# Altium schematic sheet AttoDD.SchDoc
size A4; SheetNumber: 1; SheetTotal: 1
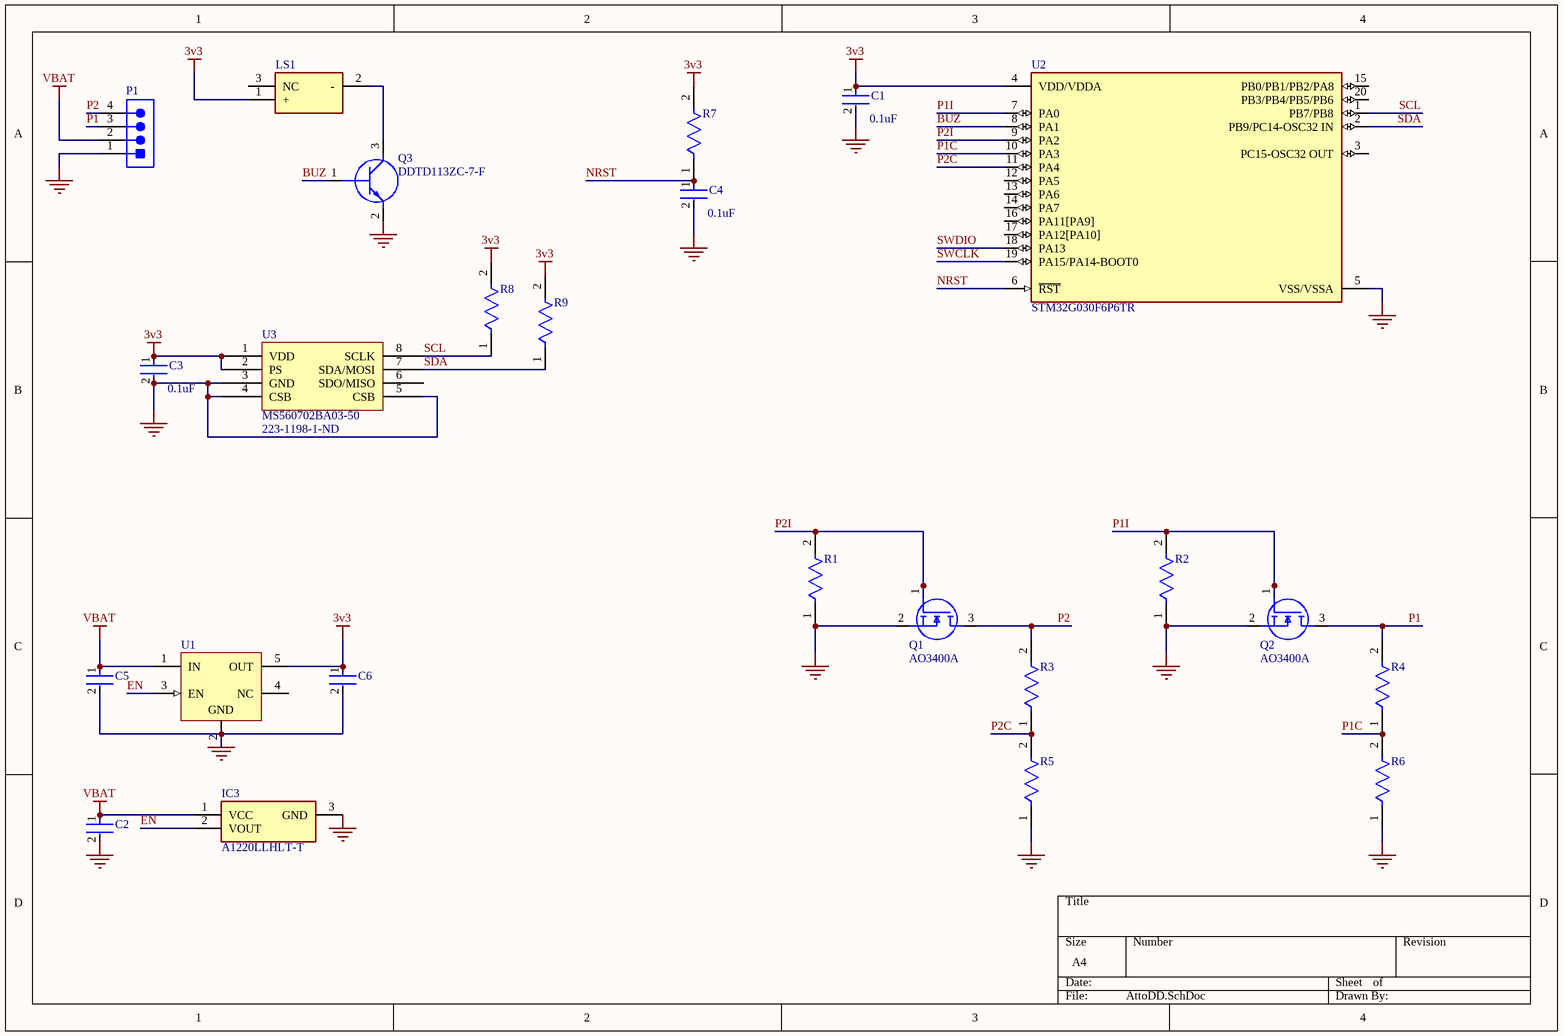
[diagram p0: AttoDD.SchDoc]

## Parts
C1  0.1uF  [FP-C0402-BB-MFG]
C2  C0402C105K8PACTU  [FP-C0402C105K8PACTU-MFG]  (value not drawn)
C3  0.1uF  [FP-C0402-BB-MFG]
C4  0.1uF  [FP-C0402-BB-MFG]
C5  C0402C105K8PACTU  [FP-C0402C105K8PACTU-MFG]  (value not drawn)
C6  C0402C105K8PACTU  [FP-C0402C105K8PACTU-MFG]  (value not drawn)
IC3  A1220LLHLT-T  [A3213ELHLTT]
LS1  CMT-0525-75-SMT-TR  [CMT052575SMTTR]  (value not drawn)
P1  GRPB041VWVN-RC  [SLIN-GRPB041VWVN-RC_V]  (value not drawn)
Q1  AO3400A  [SOT95P280X125-3N]
Q2  AO3400A  [SOT95P280X125-3N]
Q3  DDTD113ZC-7-F  [SOT96P240X110-3N]
R1  CRCW0402100KFKED  [FP-CRCW0402-e3-IPC_C]  (value not drawn)
R2  CRCW0402100KFKED  [FP-CRCW0402-e3-IPC_C]  (value not drawn)
R3  CRCW0402100KFKED  [FP-CRCW0402-e3-IPC_C]  (value not drawn)
R4  CRCW0402100KFKED  [FP-CRCW0402-e3-IPC_C]  (value not drawn)
R5  CRCW040250K0FKED  [FP-CRCW0402-e3-IPC_A]  (value not drawn)
R6  CRCW040250K0FKED  [FP-CRCW0402-e3-IPC_A]  (value not drawn)
R7  CRCW040250K0FKED  [FP-CRCW0402-e3-IPC_A]  (value not drawn)
R8  RC0402JR-074K7L  [FP-RC0402-0_4-MFG]  (value not drawn)
R9  RC0402JR-074K7L  [FP-RC0402-0_4-MFG]  (value not drawn)
U1  TLV70033DCKR  [DCK0005A_M]  (value not drawn)
U2  STM32G030F6P6TR  [FP-TSSOP20-YA-IPC_A]
U3  MS560702BA03-50  Supplier Part Number 1: 223-1198-1-ND  [MS5607]

## Nets
3v3: C1.1 C3.1 C6.1 LS1.1(+) R7.2 R8.2 R9.2 U1.5(OUT) U2.4(VDD/VDDA) U3.1(VDD) U3.2(PS)
GND: C1.2 C2.2 C3.2 C4.2 C5.2 C6.2 IC3.3(GND) P1.1 Q1.2(S) Q2.2(S) Q3.2(E) R1.1 R2.1 R5.1 R6.1 U1.2(GND) U2.5(VSS/VSSA) U3.3(GND) U3.4(CSB) U3.5(CSB)
VBAT: C2.1 C5.1 IC3.1(VCC) P1.2 U1.1(IN)
BUZ: Q3.1(B) U2.8(PA1)
EN: IC3.2(VOUT) U1.3(EN)
NRST: C4.1 R7.1 U2.6(~{RST})
P1: P1.3 Q2.3(D) R4.2
P1C: R4.1 R6.2 U2.10(PA3)
P1I: Q2.1(G) R2.2 U2.7(PA0)
P2: P1.4 Q1.3(D) R3.2
P2C: R3.1 R5.2 U2.11(PA4)
P2I: Q1.1(G) R1.2 U2.9(PA2)
SCL: R8.1 U2.1(PB7/PB8) U3.8(SCLK)
SDA: R9.1 U2.2(PB9/PC14-OSC32_IN) U3.7(SDA/MOSI)
SWCLK: U2.19(PA15/PA14-BOOT0)
SWDIO: U2.18(PA13)
NetLS1_2: LS1.2(-) Q3.3(C)

Not connected (* = marked no-connect by the designer): LS1 3(NC); U1 4(NC); U2 3(PC15-OSC32_OUT) 12(PA5) 13(PA6) 14(PA7) 15(PB0/PB1/PB2/PA8) 16(PA11[PA9]) 17(PA12[PA10]) 20(PB3/PB4/PB5/PB6); U3 6(SDO/MISO)

## Library data of the parts
C1 C3 C4 = CMP-2008-02046-2: CAP CER 0.1UF 10V X5R 0402; Manufacturer: Kemet; Manufacturer Part Number: C0402C104K8PACTU; Material: Ceramic; Capacitance: 0.10 μF; Temperature Coefficient: 15%; Tolerance: 0.1; Value: 0.10 μF; Package: C0402-BB; Temperature: -55°C to +125°C; ComponentLink2Description: Datasheet; Temperature Characteristic: X5R; Device Class L1: Passive Components; Height: 0.55mm; Lead Free: Yes; ComponentLink2URL: https://content.kemet.com/datasheets/KEM_C1002_X7R_SMD.pdf; Device Class L2: Capacitors; Temperature Range Low: -55°C; Temperature Range High: +125°C; RoHS: TRUE; Octopart: https://octopart.com/c0402c104k8pactu-kemet-140039; Automotive: No; Mouser Description: Capacitor 100 nF 10 VDC 0402; Category: Cap; Voltage Rating: 10 V; Digikey Description: CAP CER 0.1UF 10V X5R 0402; Ipc Land Pattern Name: CAPC10050X50; Device Class L3: Ceramic Capacitors
C2 C5 C6 = CMP-2008-02081-2: CAP CER 1UF 10V X5R 0402; Dielectric Material: Ceramic; Dissipation Factor: 5%; Tolerance: 10%; Number of Pins: 2; Contact Plating: Tin; Min Operating Temperature: -55°C; Termination: SMD/SMT; Lead Free: Lead Free; Construction: Flat; Voltage Rating (DC): 10V; Mount: Surface Mount; Series: C; Thickness: 0.022inch; Width: 0.5mm; Radiation Hardening: No; Capacitance: 1uF; Dielectric: X5R; Height: 0.5mm; Voltage: 10V; Length: 1mm; Depth: 0.5mm; Max Operating Temperature: 85°C; Package Quantity: 1; Packaging: Tape and Reel; RoHS Compliant: Yes; Case Code (Imperial): 0402; Case Code (Metric): 1005; REACH SVHC: No SVHC; Voltage Rating: 10V; Case/Package: 0402
IC3 = A1220LLHLT-T: Integrated Circuit; Manufacturer_Name: Allegro Microsystems; Datasheet Link: http://www.allegromicro.com/~/media/files/datasheets/a1220-1-2-3-datasheet.pdf; Height: 1.13mm; Manufacturer_Part_Number: A1220LLHLT-T; Arrow Part Number: A1220LLHLT-T; Arrow Price/Stock: https://www.arrow.com/en/products/a1220llhlt-t/allegro-microsystems
LS1 = CMT-0525-75-SMT-TR: Loudspeaker or Buzzer; Manufacturer_Name: Same Sky; Datasheet Link: https://datasheet.datasheetarchive.com/originals/distributors/Datasheets_SAMA/202edec26f194914f30bb21e54dbec55.pdf; Height: 2.8mm; Manufacturer_Part_Number: CMT-0525-75-SMT-TR
P1 = CMP-2000-06373-1: Male Header, Pitch 1.27 mm, 1 x 4 Position, Height 4 mm, Tail Length 2.3 mm, -40 to 105 degC, RoHS, Bulk; Manufacturer: Sullins; Mating Products: S9010E-04-ND / -CONNHEADER.050"4POSR/APCB / S9008E-04-ND / -CONNHEADER.050"4POSPCBGOLD / S9005E-04-ND / -CONNHEADER.050"4POSSMDGOLD; Other Names: S9014E-04; Dynamic Catalog: GRPB; Pitch: 0.050"(1.27mm); Number of Positions Loaded: All; Number of Positions: 4; Catalog Drawings: S9014ESeriesTop; Connector Type: Header,Unshrouded; Contact Finish Thickness: Flash; Number of Rows: 1; Contact Type: MalePin; Category: Connectors,Interconnects; Contact Mating Length: 0.118"(3.00mm); Family: RectangularConnectors-Headers,MalePins; Datasheet Version: Rev. C, 12/2008; Contact Finish: Gold; Termination: Solder; Manufacturer URL: http://www.sullinscorp.com/; Mounting Type: ThroughHole; Packaging: Bulk; Package Reference: GRPB041VWVN-RC; Datasheet URL: http://www.sullinscorp.com/drawings/71_GRPB___1VWVN-RC,_10957-C.pdf; Mounting Technology: ThroughHole; Package Description: Male Header, Pitch 1.27 mm, 1 x 4 Position, Height 4 mm, Tail Length 2.3 mm; Standard Package: 1
Q1 Q2 = AO3400A: MOSFET (N-Channel); Manufacturer_Name: Alpha & Omega Semiconductors; Datasheet Link: http://aosmd.com/res/data_sheets/AO3400A.pdf; Height: 1.25mm; Manufacturer_Part_Number: AO3400A; Arrow Part Number: AO3400A; Arrow Price/Stock: https://www.arrow.com/en/products/ao3400a/alpha-and-omega-semiconductor?utm_currency=USD&region=nac
Q3 = DDTD113ZC-7-F: Transistor BJT NPN; Manufacturer_Name: Diodes Incorporated; Datasheet Link: https://www.diodes.com//assets/Datasheets/DDTD_XXXX_C.pdf; Height: 1.1mm; Manufacturer_Part_Number: DDTD113ZC-7-F; Arrow Part Number: DDTD113ZC-7-F; Arrow Price/Stock: https://www.arrow.com/en/products/ddtd113zc-7-f/diodes-incorporated
R1-R4 = CMP-2002-08123-3: RES Thick Film, 100kΩ, 1%, 0.063W, 100ppm/°C, 0402; Power Rating: 63mW; Resistance: 100kR; Voltage Rating (DC): 50V; Lead Free: Lead Free; Height: 0.35mm; Contact Plating: Tin; Min Operating Temperature: -55°C; Package Quantity: 10000; Case/Package: 0402; Temperature Coefficient: 100ppm/°C; Number of Terminations: 2; Packaging: Tape and Reel; Max Power Dissipation: 63mW; Case Code (Metric): 1005; Mount: Surface Mount; Width: 0.02inch; Termination: SMD/SMT; Length: 1mm; Number of Pins: 2; Weight: 2.3E-05oz; Radiation Hardening: No; Tolerance: 1%; Military Standard: Not; Features: Automotive AEC-Q200; Depth: 0.5mm; Composition: Thick Film; Max Operating Temperature: 155°C; Voltage Rating: 50V; Case Code (Imperial): 0402
R5-R7 = CMP-02407-005152-1: RES Thick Film, 50kΩ, 1%, 0.063W, 100ppm/°C, 0402; Power Rating: 63mW; Voltage Rating: 50V; Resistance: 50kR; Package Quantity: 10000; Case/Package: 0402; Max Operating Temperature: 155°C; Case Code (Metric): 1005; Termination: SMD/SMT; Lead Free: Lead Free; Height: 0.35mm; Width: 0.5mm; Packaging: Tape and Reel; Min Operating Temperature: -55°C; Length: 1mm; Tolerance: 1%; Case Code (Imperial): 0402; Weight: 2.3E-05oz
R8 R9 = CMP-2002-08011-2: Tolerance: 5%; Power Rating: 63mW; Resistance: 4.7kΩ; Voltage Rating: 50V; Temperature Coefficient: 100ppm/°C; Composition: Thick Film; Max Operating Temperature: 155°C; Case/Package: 0402; Depth: 500µm; Packaging: Tape & Reel; Number of Pins: 2; Schedule B: 8533210045, 8533210045; Case Code (Imperial): 0402; Termination: SMD/SMT; Military Standard: Not; Lead Free: Lead Free; Width: 500µm; REACH SVHC: No SVHC; Max Power Dissipation: 63mW; Voltage Rating (AC): 50V; Features: Moisture Resistant; Min Operating Temperature: -55°C; Number of Terminations: 2; RoHS: Compliant; Height: 350µm; Voltage Rating (DC): 50V; Length: 1mm
U1 = CMP-0394-00820-2: Single Output LDO, 200 mA, Fixed 3.3 V Output, 2 to 5.5 V Input, with Low IQ, 5-pin SC70 (DCK), -40 to 125 degC, Green (RoHS & no Sb/Br); Manufacturer: Texas Instruments; SubFamily: Single Channel LDO; Fixed Output Options(V): 3.3; Vin(Max)(V): 5.5; Vin(Min)(V): 2; Vdo(Typ)(mV): 175; Iq(Typ)(mA): 0.03; Iout(Max)(A): 0.2; Code_JEDEC: MO-203; ComponentLink2URL: http://www.ti.com/general/docs/lit/getliterature.tsp?genericPartNumber=TLV70033&fileType=pdf; PackageDescription: 5-Pin Plastic Small-Outline, Body 2 x 1.25 mm, Pitch 0.65 mm; ComponentLink1Description: Manufacturer URL; PartNumber: TLV70033DCKR; Vout Adj(Max)(V): 3.3; ComponentLink1URL: http://www.ti.com/; ComponentLink2Description: Datasheet; Vout Adj(Min)(V): 3.3; Mounting Technology: Surface Mount; Eco-Plan: Green (RoHS & no Sb/Br); Accuracy(%): 2; DatasheetVersion: SLVSA00D; ComponentLink3URL: http://www.ti.com/litv/pdf/mpds025f; PackageReference: DCK0005A; PackageVersion: 4093553-3/G; ComponentLink3Description: Package Specification
U2 = CMP-12105-000113-1: IC MCU 32BIT 32KB FLASH 20TSSOP; RoHS Compliant: Yes
U3 = CMP-040-000016-3: Barometric Pressure Sensor I2C/SPI; Reviewed By: Adam Rising; Made By: *; Supplier 1: Digi-Key; Design Item ID: MS560702BA03-50; Source: Sensors.SchLib